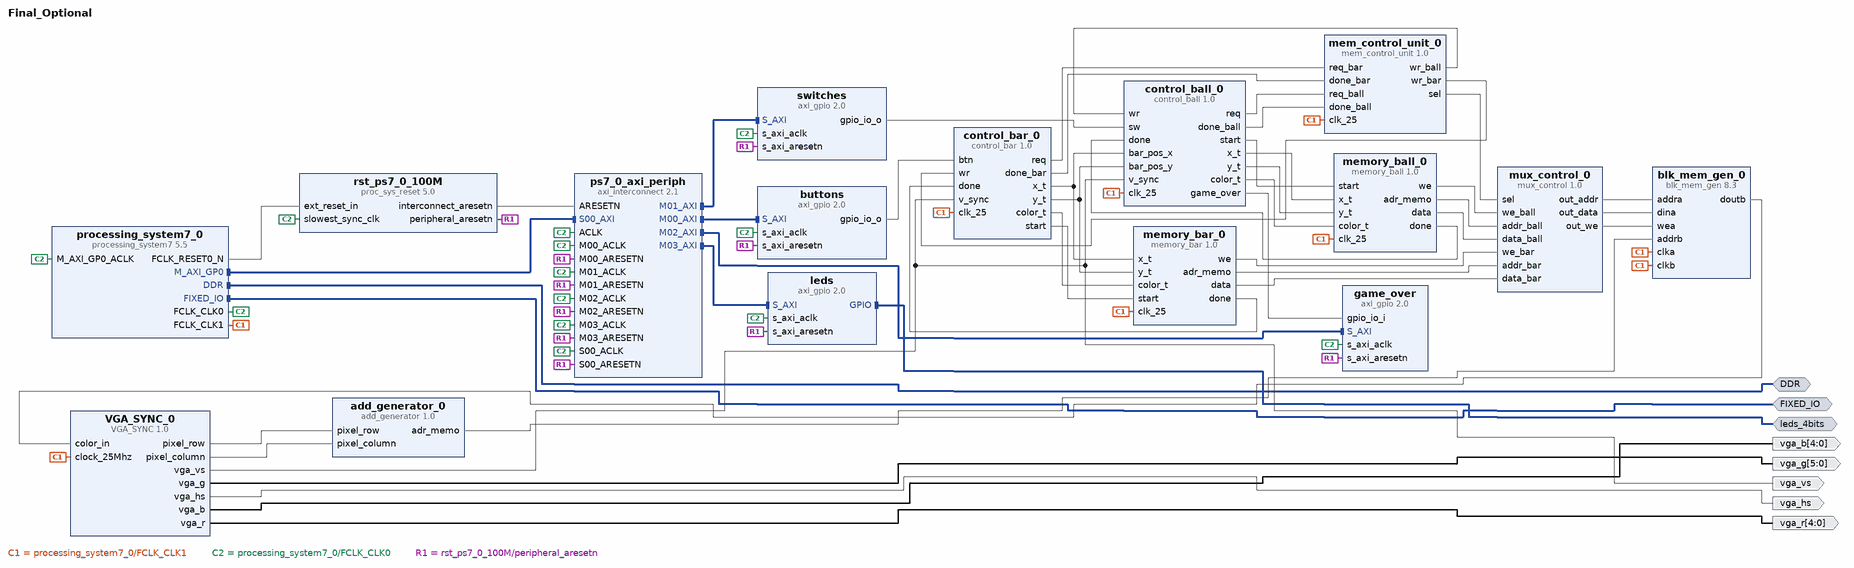
[diagram p0: block diagram of the top level]
# Vivado block design Final_Optional, xc7z010clg400-1, Vivado 2017.2
create_bd_design Final_Optional

create_bd_intf_port -mode Master -vlnv xilinx.com:interface:ddrx_rtl:1.0 DDR
create_bd_intf_port -mode Master -vlnv xilinx.com:display_processing_system7:fixedio_rtl:1.0 FIXED_IO
create_bd_intf_port -mode Master -vlnv xilinx.com:interface:gpio_rtl:1.0 leds_4bits
create_bd_port -dir O -from 5 -to 0 vga_g
create_bd_port -dir O vga_vs
create_bd_port -dir O vga_hs
create_bd_port -dir O -from 4 -to 0 vga_b
create_bd_port -dir O -from 4 -to 0 vga_r

create_bd_cell -type ip -vlnv ALU:user:VGA_SYNC:1.0 VGA_SYNC_0
create_bd_cell -type ip -vlnv ALU:user:add_generator:1.0 add_generator_0
create_bd_cell -type ip -vlnv ALU:user:memory_ball:1.0 memory_ball_0
create_bd_cell -type ip -vlnv ALU:user:memory_bar:1.0 memory_bar_0
create_bd_cell -type ip -vlnv xilinx.com:ip:blk_mem_gen:8.3 blk_mem_gen_0
set_property -dict [list \
  CONFIG.Memory_Type Simple_Dual_Port_RAM \
  CONFIG.Enable_32bit_Address false \
  CONFIG.Use_Byte_Write_Enable false \
  CONFIG.Assume_Synchronous_Clk true \
  CONFIG.Write_Width_A 3 \
  CONFIG.Write_Depth_A 131072 \
  CONFIG.Operating_Mode_A NO_CHANGE \
  CONFIG.Enable_A Always_Enabled \
  CONFIG.Write_Width_B 3 \
  CONFIG.Read_Width_B 3 \
  CONFIG.Enable_B Always_Enabled \
  CONFIG.Register_PortB_Output_of_Memory_Primitives false \
  CONFIG.Port_A_Write_Rate 50 \
  CONFIG.Port_B_Clock 100 \
  CONFIG.Port_B_Enable_Rate 100 \
  CONFIG.use_bram_block Stand_Alone \
] [get_bd_cells blk_mem_gen_0]
create_bd_cell -type ip -vlnv ALU:user:mem_control_unit:1.0 mem_control_unit_0
create_bd_cell -type ip -vlnv ALU:user:mux_control:1.0 mux_control_0
create_bd_cell -type ip -vlnv ALU:user:control_bar:1.0 control_bar_0
create_bd_cell -type ip -vlnv xilinx.com:ip:processing_system7:5.5 processing_system7_0
set_property -dict [list \
  CONFIG.PCW_UIPARAM_DDR_FREQ_MHZ 525 \
  CONFIG.PCW_CRYSTAL_PERIPHERAL_FREQMHZ 50.000000 \
  CONFIG.PCW_APU_PERIPHERAL_FREQMHZ 650 \
  CONFIG.PCW_SDIO_PERIPHERAL_FREQMHZ 50 \
  CONFIG.PCW_FPGA0_PERIPHERAL_FREQMHZ 100 \
  CONFIG.PCW_FPGA1_PERIPHERAL_FREQMHZ 25 \
  CONFIG.PCW_EN_CLK1_PORT 1 \
  CONFIG.PCW_PRESET_BANK1_VOLTAGE {LVCMOS 1.8V} \
  CONFIG.PCW_UIPARAM_DDR_PARTNO {MT41K128M16 JT-125} \
  CONFIG.PCW_QSPI_PERIPHERAL_ENABLE 1 \
  CONFIG.PCW_QSPI_GRP_SINGLE_SS_ENABLE 1 \
  CONFIG.PCW_QSPI_GRP_FBCLK_ENABLE 1 \
  CONFIG.PCW_ENET0_PERIPHERAL_ENABLE 1 \
  CONFIG.PCW_ENET0_ENET0_IO {MIO 16 .. 27} \
  CONFIG.PCW_ENET0_GRP_MDIO_ENABLE 1 \
  CONFIG.PCW_ENET0_GRP_MDIO_IO {MIO 52 .. 53} \
  CONFIG.PCW_ENET0_RESET_ENABLE 0 \
  CONFIG.PCW_SD0_PERIPHERAL_ENABLE 0 \
  CONFIG.PCW_UART1_PERIPHERAL_ENABLE 1 \
  CONFIG.PCW_TTC0_PERIPHERAL_ENABLE 1 \
  CONFIG.PCW_USB0_PERIPHERAL_ENABLE 0 \
  CONFIG.PCW_USB0_RESET_ENABLE 1 \
  CONFIG.PCW_USB0_RESET_IO {MIO 46} \
  CONFIG.PCW_GPIO_MIO_GPIO_ENABLE 1 \
] [get_bd_cells processing_system7_0]
# 105 more settings of processing_system7_0 are not shown: defaults, MIO pin electricals, DDR timing, and values the tool derives
create_bd_cell -type ip -vlnv xilinx.com:ip:axi_gpio:2.0 buttons
set_property -dict {CONFIG.C_GPIO_WIDTH 4 CONFIG.C_ALL_OUTPUTS 1} [get_bd_cells buttons]
create_bd_cell -type ip -vlnv xilinx.com:ip:axi_gpio:2.0 switches
set_property -dict {CONFIG.C_GPIO_WIDTH 4 CONFIG.C_ALL_OUTPUTS 1} [get_bd_cells switches]
create_bd_cell -type ip -vlnv ALU:user:control_ball:1.0 control_ball_0
create_bd_cell -type ip -vlnv xilinx.com:ip:axi_interconnect:2.1 ps7_0_axi_periph
set_property -dict {CONFIG.NUM_MI 4} [get_bd_cells ps7_0_axi_periph]
create_bd_cell -type ip -vlnv xilinx.com:ip:proc_sys_reset:5.0 rst_ps7_0_100M
create_bd_cell -type ip -vlnv xilinx.com:ip:axi_gpio:2.0 game_over
set_property -dict {CONFIG.C_GPIO_WIDTH 1 CONFIG.C_ALL_INPUTS 1} [get_bd_cells game_over]
create_bd_cell -type ip -vlnv xilinx.com:ip:axi_gpio:2.0 leds
set_property -dict {CONFIG.USE_BOARD_FLOW true CONFIG.GPIO_BOARD_INTERFACE leds_4bits} [get_bd_cells leds]

# ---- connections ----

connect_bd_intf_net [get_bd_intf_pins processing_system7_0/M_AXI_GP0] [get_bd_intf_pins ps7_0_axi_periph/S00_AXI]
connect_bd_intf_net [get_bd_intf_pins ps7_0_axi_periph/M00_AXI] [get_bd_intf_pins buttons/S_AXI]
connect_bd_intf_net [get_bd_intf_pins ps7_0_axi_periph/M01_AXI] [get_bd_intf_pins switches/S_AXI]
connect_bd_intf_net [get_bd_intf_pins ps7_0_axi_periph/M02_AXI] [get_bd_intf_pins game_over/S_AXI]
connect_bd_intf_net [get_bd_intf_pins ps7_0_axi_periph/M03_AXI] [get_bd_intf_pins leds/S_AXI]
connect_bd_intf_net [get_bd_intf_ports DDR] [get_bd_intf_pins processing_system7_0/DDR]
connect_bd_intf_net [get_bd_intf_ports FIXED_IO] [get_bd_intf_pins processing_system7_0/FIXED_IO]
connect_bd_intf_net [get_bd_intf_ports leds_4bits] [get_bd_intf_pins leds/GPIO]
connect_bd_net [get_bd_pins memory_bar_0/done] [get_bd_pins control_bar_0/done]
connect_bd_net [get_bd_pins control_bar_0/x_t] [get_bd_pins memory_bar_0/x_t] [get_bd_pins control_ball_0/bar_pos_x]
connect_bd_net [get_bd_pins control_bar_0/y_t] [get_bd_pins memory_bar_0/y_t] [get_bd_pins control_ball_0/bar_pos_y]
connect_bd_net [get_bd_pins control_bar_0/color_t] [get_bd_pins memory_bar_0/color_t]
connect_bd_net [get_bd_pins control_bar_0/start] [get_bd_pins memory_bar_0/start]
connect_bd_net [get_bd_pins add_generator_0/adr_memo] [get_bd_pins blk_mem_gen_0/addrb]
connect_bd_net [get_bd_pins blk_mem_gen_0/doutb] [get_bd_pins VGA_SYNC_0/color_in]
connect_bd_net [get_bd_pins VGA_SYNC_0/pixel_row] [get_bd_pins add_generator_0/pixel_row]
connect_bd_net [get_bd_pins VGA_SYNC_0/pixel_column] [get_bd_pins add_generator_0/pixel_column]
connect_bd_net [get_bd_pins VGA_SYNC_0/vga_g] [get_bd_ports vga_g]
connect_bd_net [get_bd_pins VGA_SYNC_0/vga_vs] [get_bd_ports vga_vs] [get_bd_pins control_bar_0/v_sync] [get_bd_pins control_ball_0/v_sync]
connect_bd_net [get_bd_pins VGA_SYNC_0/vga_hs] [get_bd_ports vga_hs]
connect_bd_net [get_bd_pins VGA_SYNC_0/vga_b] [get_bd_ports vga_b]
connect_bd_net [get_bd_pins VGA_SYNC_0/vga_r] [get_bd_ports vga_r]
connect_bd_net [get_bd_pins mem_control_unit_0/sel] [get_bd_pins mux_control_0/sel]
connect_bd_net [get_bd_pins mem_control_unit_0/wr_bar] [get_bd_pins control_bar_0/wr]
connect_bd_net [get_bd_pins control_bar_0/req] [get_bd_pins mem_control_unit_0/req_bar]
connect_bd_net [get_bd_pins control_bar_0/done_bar] [get_bd_pins mem_control_unit_0/done_bar]
connect_bd_net [get_bd_pins memory_ball_0/we] [get_bd_pins mux_control_0/we_ball]
connect_bd_net [get_bd_pins memory_bar_0/we] [get_bd_pins mux_control_0/we_bar]
connect_bd_net [get_bd_pins memory_ball_0/adr_memo] [get_bd_pins mux_control_0/addr_ball]
connect_bd_net [get_bd_pins memory_ball_0/data] [get_bd_pins mux_control_0/data_ball]
connect_bd_net [get_bd_pins memory_bar_0/adr_memo] [get_bd_pins mux_control_0/addr_bar]
connect_bd_net [get_bd_pins memory_bar_0/data] [get_bd_pins mux_control_0/data_bar]
connect_bd_net [get_bd_pins mux_control_0/out_addr] [get_bd_pins blk_mem_gen_0/addra]
connect_bd_net [get_bd_pins mux_control_0/out_data] [get_bd_pins blk_mem_gen_0/dina]
connect_bd_net [get_bd_pins mux_control_0/out_we] [get_bd_pins blk_mem_gen_0/wea]
connect_bd_net [get_bd_pins control_ball_0/start] [get_bd_pins memory_ball_0/start]
connect_bd_net [get_bd_pins control_ball_0/x_t] [get_bd_pins memory_ball_0/x_t]
connect_bd_net [get_bd_pins control_ball_0/y_t] [get_bd_pins memory_ball_0/y_t]
connect_bd_net [get_bd_pins control_ball_0/color_t] [get_bd_pins memory_ball_0/color_t]
connect_bd_net [get_bd_pins control_ball_0/req] [get_bd_pins mem_control_unit_0/req_ball]
connect_bd_net [get_bd_pins mem_control_unit_0/wr_ball] [get_bd_pins control_ball_0/wr]
connect_bd_net [get_bd_pins control_ball_0/done_ball] [get_bd_pins mem_control_unit_0/done_ball]
connect_bd_net [get_bd_pins memory_ball_0/done] [get_bd_pins control_ball_0/done]
connect_bd_net [get_bd_pins processing_system7_0/FCLK_CLK1] \
  [get_bd_pins control_bar_0/clk_25] [get_bd_pins mem_control_unit_0/clk_25] [get_bd_pins memory_ball_0/clk_25] \
  [get_bd_pins memory_bar_0/clk_25] [get_bd_pins blk_mem_gen_0/clka] [get_bd_pins blk_mem_gen_0/clkb] \
  [get_bd_pins VGA_SYNC_0/clock_25Mhz] [get_bd_pins control_ball_0/clk_25]
connect_bd_net [get_bd_pins buttons/gpio_io_o] [get_bd_pins control_bar_0/btn]
connect_bd_net [get_bd_pins switches/gpio_io_o] [get_bd_pins control_ball_0/sw]
connect_bd_net [get_bd_pins processing_system7_0/FCLK_CLK0] \
  [get_bd_pins processing_system7_0/M_AXI_GP0_ACLK] [get_bd_pins buttons/s_axi_aclk] [get_bd_pins switches/s_axi_aclk] \
  [get_bd_pins ps7_0_axi_periph/S00_ACLK] [get_bd_pins rst_ps7_0_100M/slowest_sync_clk] \
  [get_bd_pins ps7_0_axi_periph/M00_ACLK] [get_bd_pins ps7_0_axi_periph/ACLK] [get_bd_pins ps7_0_axi_periph/M01_ACLK] \
  [get_bd_pins game_over/s_axi_aclk] [get_bd_pins ps7_0_axi_periph/M02_ACLK] [get_bd_pins leds/s_axi_aclk] \
  [get_bd_pins ps7_0_axi_periph/M03_ACLK]
connect_bd_net [get_bd_pins processing_system7_0/FCLK_RESET0_N] [get_bd_pins rst_ps7_0_100M/ext_reset_in]
connect_bd_net [get_bd_pins rst_ps7_0_100M/peripheral_aresetn] \
  [get_bd_pins ps7_0_axi_periph/S00_ARESETN] [get_bd_pins buttons/s_axi_aresetn] [get_bd_pins switches/s_axi_aresetn] \
  [get_bd_pins ps7_0_axi_periph/M00_ARESETN] [get_bd_pins ps7_0_axi_periph/M01_ARESETN] [get_bd_pins game_over/s_axi_aresetn] \
  [get_bd_pins ps7_0_axi_periph/M02_ARESETN] [get_bd_pins leds/s_axi_aresetn] [get_bd_pins ps7_0_axi_periph/M03_ARESETN]
connect_bd_net [get_bd_pins rst_ps7_0_100M/interconnect_aresetn] [get_bd_pins ps7_0_axi_periph/ARESETN]
connect_bd_net [get_bd_pins control_ball_0/game_over] [get_bd_pins game_over/gpio_io_i]

# ---- address map ----
assign_bd_address -offset 0x41200000 -range 64K -target_address_space [get_bd_addr_spaces processing_system7_0/Data] [get_bd_addr_segs game_over/S_AXI/Reg]
assign_bd_address -offset 0x41210000 -range 64K -target_address_space [get_bd_addr_spaces processing_system7_0/Data] [get_bd_addr_segs buttons/S_AXI/Reg]
assign_bd_address -offset 0x41220000 -range 64K -target_address_space [get_bd_addr_spaces processing_system7_0/Data] [get_bd_addr_segs switches/S_AXI/Reg]
assign_bd_address -offset 0x41230000 -range 64K -target_address_space [get_bd_addr_spaces processing_system7_0/Data] [get_bd_addr_segs leds/S_AXI/Reg]

validate_bd_design
save_bd_design
